# Altium schematic sheet RF24_Block.SchDoc
size A4; SheetNumber: 5; SheetTotal: 5
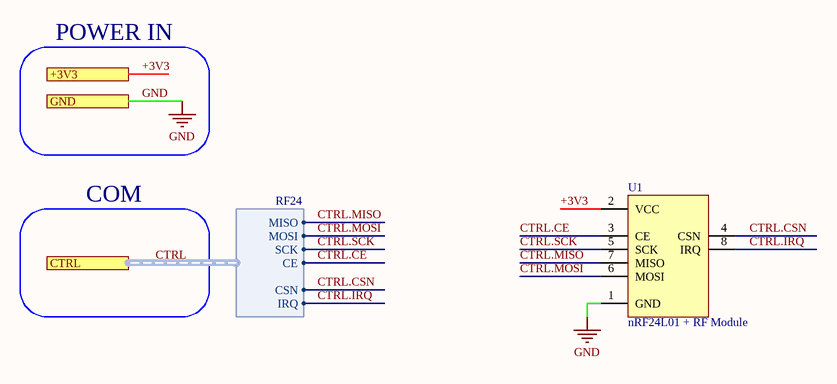
[diagram p0: RF24_Block.SchDoc]

## Parts
U1  nRF24L01 + RF Module  [nRF24L01+Module]

## Ports
+3V3 (see WaterLevelControl-v1.0_top[3C], DCDC_Buck_1A[4B]), CTRL (harness RF24, see WaterLevelControl-v1.0_top[3C]), GND (see WaterLevelControl-v1.0_top[3C], DCDC_Buck_1A[1B], Input_Trafo[3B])

## Harnesses
RF24: CE, MISO, MOSI, SCK, CSN, IRQ

## Nets
GND: U1.1(GND) ; port GND
+3V3: U1.2(VCC) ; port +3V3
CTRL.CE: U1.3(CE) ; port CTRL.CE
CTRL.CSN: U1.4(CSN) ; port CTRL.CSN
CTRL.IRQ: U1.8(IRQ) ; port CTRL.IRQ
CTRL.MISO: U1.7(MISO) ; port CTRL.MISO
CTRL.MOSI: U1.6(MOSI) ; port CTRL.MOSI
CTRL.SCK: U1.5(SCK) ; port CTRL.SCK

## Buses and harness runs
harness CTRL = port CTRL

## Notes on the sheet
- POWER IN
- COM